# EAGLE design poe (EAGLE 9.6.2)
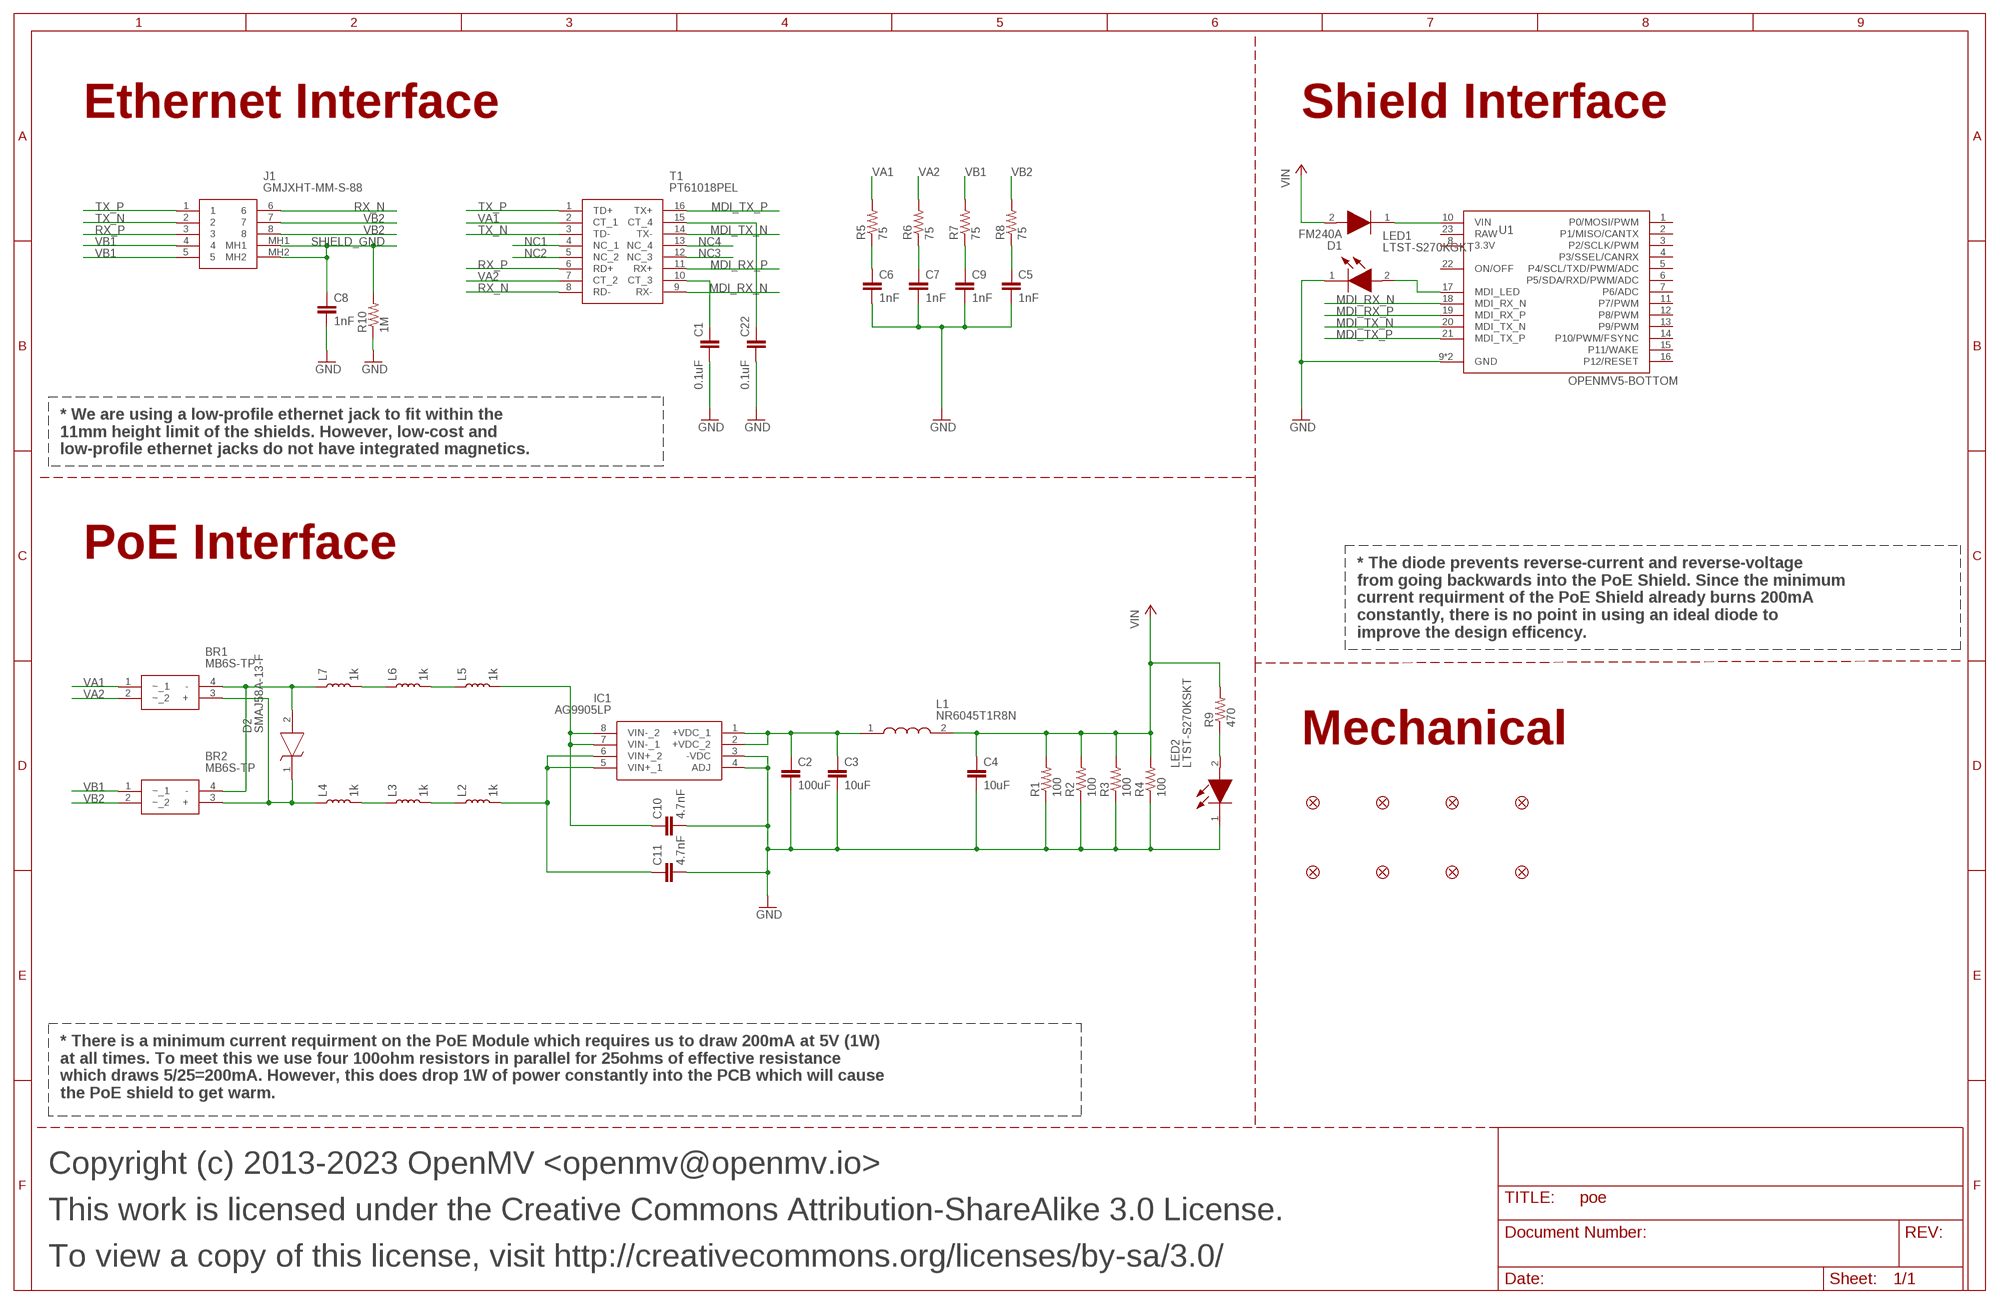
[diagram p0: schematic, sheet 1]

## Parts
BR1  MB6S-TP  [SOP254P665X270-4N]
BR2  MB6S-TP  [SOP254P665X270-4N]
C1  0.1uF  C-EUC0201  [C0201]
C2  100uF  C-EUC1206  [C1206]
C3  10uF  C-EUC0402  [C0402]
C4  10uF  C-EUC0402  [C0402]
C5  1nF  C-EUC1206  [C1206]
C6  1nF  C-EUC1206  [C1206]
C7  1nF  C-EUC1206  [C1206]
C8  1nF  C-EUC1206  [C1206]
C9  1nF  C-EUC1206  [C1206]
C10  4.7nF  C-EUC1812  [C1812]
C11  4.7nF  C-EUC1812  [C1812]
C22  0.1uF  C-EUC0201  [C0201]
D1  FM240A  [DIOM5025X231N]
D2  SMAJ58A-13-F  [DIOM5226X230N]
FD1  FIDUCIAL1X2  [FIDUCIAL-1X2]
FD2  FIDUCIAL1X2  [FIDUCIAL-1X2]
FD3  FIDUCIAL1X2  [FIDUCIAL-1X2]
FD4  FIDUCIAL1X2  [FIDUCIAL-1X2]
FD5  FIDUCIAL1X2  [FIDUCIAL-1X2]
FD6  FIDUCIAL1X2  [FIDUCIAL-1X2]
FD7  FIDUCIAL1X2  [FIDUCIAL-1X2]
FD8  FIDUCIAL1X2  [FIDUCIAL-1X2]
IC1  AG9905LP  [AG9905LP]
J1  GMJXHT-MM-S-88  [GMJXHTMMS88]
L1  NR6045T1R8N  [NR6045T1R8N]
L2  1k  INDUCTOR-0402-3.9NH  [0402]
L3  1k  INDUCTOR-0402-3.9NH  [0402]
L4  1k  INDUCTOR-0402-3.9NH  [0402]
L5  1k  INDUCTOR-0402-3.9NH  [0402]
L6  1k  INDUCTOR-0402-3.9NH  [0402]
L7  1k  INDUCTOR-0402-3.9NH  [0402]
LED1  LTST-S270KGKT  [LTSTS270K]
LED2  LTST-S270KSKT  [LTSTS270K]
R1  100  R-US_R2512  [R2512]
R2  100  R-US_R2512  [R2512]
R3  100  R-US_R2512  [R2512]
R4  100  R-US_R2512  [R2512]
R5  75  R-US_R0402  [R0402]
R6  75  R-US_R0402  [R0402]
R7  75  R-US_R0402  [R0402]
R8  75  R-US_R0402  [R0402]
R9  470  R-US_R0603  [R0603]
R10  1M  R-US_R1206  [R1206]
T1  PT61018PEL  [SOIC127P930X565-16N]
U1  OPENMV5-BOTTOM  [OPENMV5-BOTTOM]

## Nets
GND [gnd]: C1.2 C2.2 C3.2 C4.2 C5.2 C6.2 C7.2 C8.2 C9.2 C10.2 C11.2 C22.2 IC1.3(-VDC) IC1.4(ADJ) LED1.1(K) LED2.1(K) R1.1 R2.1 R3.1 R4.1 R10.1 U1.9(GND) U1.24(GND)
MDI_LED [signal]: LED1.2(A) U1.17(MDI_LED)
MDI_RX_CT [signal]: C1.1 T1.10(CT_3)
MDI_RX_N [mdi]: T1.9(RX-) U1.18(MDI_RX_N)
MDI_RX_P [mdi]: T1.11(RX+) U1.19(MDI_RX_P)
MDI_TX_CT [signal]: C22.1 T1.15(CT_4)
MDI_TX_N [mdi]: T1.14(TX-) U1.20(MDI_TX_N)
MDI_TX_P [mdi]: T1.16(TX+) U1.21(MDI_TX_P)
NC1 [iso]: T1.4(NC_1)
NC2 [iso]: T1.5(NC_2)
NC3 [mdi]: T1.12(NC_3)
NC4 [mdi]: T1.13(NC_4)
POE_VIN_INT_N [iso]: C10.1 IC1.7(VIN-_1) IC1.8(VIN-_2) L5.2
POE_VIN_INT_P [iso]: C11.1 IC1.5(VIN+_1) IC1.6(VIN+_2) L2.2
POE_VIN_N [iso]: BR1.4(-) BR2.4(-) D2.2(A) L7.1
POE_VIN_N0 [iso]: L6.1 L7.2
POE_VIN_N1 [iso]: L5.1 L6.2
POE_VIN_P [iso]: BR1.3(+) BR2.3(+) D2.1(K) L4.1
POE_VIN_P0 [iso]: L3.1 L4.2
POE_VIN_P1 [iso]: L2.1 L3.2
RX_N [iso]: J1.6 T1.8(RD-)
RX_P [iso]: J1.3 T1.6(RD+)
SHIELD_GND [iso]: C8.1 J1.MH1 J1.MH2 R10.2
TX_N [iso]: J1.2 T1.3(TD-)
TX_P [iso]: J1.1 T1.1(TD+)
VA1 [iso]: BR1.1(~_1) R5.2 T1.2(CT_1)
VA1_ISO [iso]: C6.1 R5.1
VA2 [iso]: BR1.2(~_2) R6.2 T1.7(CT_2)
VA2_ISO [iso]: C7.1 R6.1
VB1 [iso]: BR2.1(~_1) J1.4 J1.5 R7.2
VB1_ISO [iso]: C9.1 R7.1
VB2 [iso]: BR2.2(~_2) J1.7 J1.8 R8.2
VB2_ISO [iso]: C5.1 R8.1
VDC [power]: C2.1 C3.1 IC1.1(+VDC_1) IC1.2(+VDC_2) L1.1
VIN [power]: C4.1 D1.2(A) L1.2 R1.2 R2.2 R3.2 R4.2 R9.2
VIN_INT [power]: D1.1(K) U1.10(VIN)
VIN_LED [signal]: LED2.2(A) R9.1
Unconnected: U1.1(P0/MOSI/PWM) U1.2(P1/MISO/CANTX) U1.3(P2/SCLK/PWM) U1.4(P3/SSEL/CANRX) U1.5(P4/SCL/TXD/PWM/ADC) U1.6(P5/SDA/RXD/PWM/ADC) U1.7(P6/ADC) U1.8(3.3V) U1.11(P7/PWM) U1.12(P8/PWM) U1.13(P9/PWM) U1.14(P10/PWM/FSYNC) U1.15(P11/WAKE) U1.16(P12/RESET) U1.22(ON/OFF) U1.23(RAW)

## Notes on the sheet
- Ethernet Interface | Shield Interface
- * We are using a low-profile ethernet jack to fit within the
  11mm height limit of the shields. However, low-cost and
  low-profile ethernet jacks do not have integrated magnetics.
- PoE Interface
- * The diode prevents reverse-current and reverse-voltage
  from going backwards into the PoE Shield. Since the minimum
  current requirment of the PoE Shield already burns 200mA
  constantly, there is no point in using an ideal diode to
  improve the design efficency.
- Mechanical
- * There is a minimum current requirment on the PoE Module which requires us to draw 200mA at 5V (1W)
  at all times. To meet this we use four 100ohm resistors in parallel for 25ohms of effective resistance
  which draws 5/25=200mA. However, this does drop 1W of power constantly into the PCB which will cause
  the PoE shield to get warm.
- Copyright (c) 2013-2023 OpenMV <openmv@openmv.io>
- This work is licensed under the Creative Commons Attribution-ShareAlike 3.0 License.
- To view a copy of this license, visit http://creativecommons.org/licenses/by-sa/3.0/

## Library data of the parts
BR1 BR2 = MB6S-TP:MB6S-TP: MICRO COMMERCIAL COMPONENTS - MB6S-TP - BRIDGE RECTIFIER, 500mA, 600V Source: Datasheet <https://componentsearchengine.com/Datasheets/2/MB6S-TP.pdf>; DESCRIPTION: MICRO COMMERCIAL COMPONENTS - MB6S-TP - BRIDGE RECTIFIER, 500mA, 600V; HEIGHT: 2.7mm; MANUFACTURER_NAME: MCC; MANUFACTURER_PART_NUMBER: MB6S-TP; MOUSER_PART_NUMBER: 833-MB6S-TP; MOUSER_PRICE-STOCK: https://www.mouser.co.uk/ProductDetail/Micro-Commercial-Components-MCC/MB6S-TP?qs=O2qRfqcg9D9hSJLw3ZCqJw%3D%3D; MPN: MB6S-TP
C1 C22 = rcl:C-EU: CAPACITOR, European symbol; MPN: CL03A104KQ3NNNC; SPICEPREFIX: C
C2 = rcl:C-EU: CAPACITOR, European symbol; MPN: CL31A107MQHNNWE; SPICEPREFIX: C
C3 C4 = rcl:C-EU: CAPACITOR, European symbol; MPN: GRM155R60J106ME05D; SPICEPREFIX: C
C5-C9 = rcl:C-EU: CAPACITOR, European symbol; MPN: 1206B102K252CT; SPICEPREFIX: C
C10 C11 = rcl:C-EU: CAPACITOR, European symbol; MPN: 202S43W472KV4E; SPICEPREFIX: C
D1 = FM240A:FM240A: Diodes - General Purpose, Power, Switching GP Si Rectifier SMB,2A,40V Source: Datasheet <https://ms.componentsearchengine.com/Datasheets/1/FM240A.pdf>; DESCRIPTION: Diodes - General Purpose, Power, Switching GP Si Rectifier SMB,2A,40V; HEIGHT: 2.31mm; MANUFACTURER_NAME: Rectron; MANUFACTURER_PART_NUMBER: FM240A; MOUSER_PART_NUMBER: 583-FM240A; MOUSER_PRICE-STOCK: https://www.mouser.co.uk/ProductDetail/Rectron/FM240A?qs=7pEAo90IqNG7sknZwmLYhQ%3D%3D; MPN: FM240A
D2 = SMAJ58A-13-F:SMAJ58A-13-F: Diodes Inc SMAJ58A-13-F, Uni-Directional TVS Diode, 400W, 2-Pin DO-214AC Source: Datasheet <https://componentsearchengine.com/Datasheets/1/SMAJ58A-13-F.pdf>; DESCRIPTION: Diodes Inc SMAJ58A-13-F, Uni-Directional TVS Diode, 400W, 2-Pin DO-214AC; HEIGHT: 2.3mm; MANUFACTURER_NAME: Diodes Inc.; MANUFACTURER_PART_NUMBER: SMAJ58A-13-F; MOUSER_PART_NUMBER: 621-SMAJ58A-13-F; MOUSER_PRICE-STOCK: https://www.mouser.co.uk/ProductDetail/Diodes-Incorporated/SMAJ58A-13-F?qs=gaDBXWSqsDABoBswSRRvMQ%3D%3D; MPN: SMAJ58A/TR13
FD1-FD8 = SparkFun-Aesthetics:FIDUCIAL: Fiducial Alignment Points Point-of-reference for pick-and-place machines and other optical instruments.
IC1 = Ag9905LP:AG9905LP: Power Management Modules IEEE802.3af PD module. 5V 7W, low profile Source: Datasheet <https://silvertel.com/images/datasheets/Ag9900M-datasheet-ultra-miniature-isolated-Power-over-Ethernet-POE-module.pdf>; DESCRIPTION: Power Management Modules IEEE802.3af PD module. 5V 7W, low profile; HEIGHT: 8.5mm; MANUFACTURER_NAME: Silvertel; MANUFACTURER_PART_NUMBER: Ag9905LP; MOUSER_PART_NUMBER: 480-AG9905LP; MOUSER_PRICE-STOCK: https://www.mouser.co.uk/ProductDetail/Silvertel/Ag9905LP?qs=OlC7AqGiEDm9ZoM6zJQCoQ%3D%3D; MPN: Ag9905LP
J1 = GMJXHT-MM-S-88:GMJXHT-MM-S-88: MODJACK MIDMOUNT 8P8C SHIELD RoHS COMPLIANT Source: Datasheet <http://www.kycon.com/Pub_Eng_Draw/GMJXHT-MM-S-88.pdf>; DESCRIPTION: MODJACK MIDMOUNT 8P8C SHIELD RoHS COMPLIANT; HEIGHT: 10.1mm; MANUFACTURER_NAME: Kycon; MANUFACTURER_PART_NUMBER: GMJXHT-MM-S-88; MOUSER_PART_NUMBER: 806-GMJXHT-MM-S-88; MOUSER_PRICE-STOCK: https://www.mouser.co.uk/ProductDetail/Kycon/GMJXHT-MM-S-88?qs=2OnyuXx6vpiODS6CjVUhnA%3D%3D; MPN: GMJXHT-MM-S-88
L1 = NR6045T1R8N:NR6045T1R8N: Inductor Power Shielded Wirewound 1.8uH 30% 100KHz Ferrite 3.7A 0.0234Ohm DCR 2424 T/R Source: Datasheet <https://www.mouser.in/datasheet/2/396/wound04_e-1290968.pdf>; DESCRIPTION: Inductor Power Shielded Wirewound 1.8uH 30% 100KHz Ferrite 3.7A 0.0234Ohm DCR 2424 T/R; HEIGHT: 4.5mm; MANUFACTURER_NAME: TAIYO YUDEN; MANUFACTURER_PART_NUMBER: NR6045T1R8N; MOUSER_PART_NUMBER: 963-NR6045T1R8N; MOUSER_PRICE-STOCK: https://www.mouser.co.uk/ProductDetail/Taiyo-Yuden/NR6045T1R8N?qs=PzICbMaShUeSTOagIkrBuw%3D%3D; MPN: NR6045T1R8N
L2-L7 = SparkFun-Coils:INDUCTOR: Inductors Resist changes in electrical current. Basically a coil of wire. SparkFun Products: SparkFun Load Cell Amplifier - HX711 <https://www.sparkfun.com/products/13879> IOIO-OTG - V2.2 <https://www.sparkfun.com/products/13613>; MPN: BBPY00100505102Y00; PROD_ID: NDUC-13457; VALUE: 3.9NH
LED1 = LTST-S270K:LTST-S270KGKT: LED,0603,Side View,Green,35mcd Lite-On LTST-S270KGKT Green LED,571 nm 1608 (0603) Side View, Rectangle Lens SMD package Source: Datasheet <https://www.mouser.com/datasheet/2/239/LTST-S270KGKT-1175381.pdf>; DESCRIPTION: LED,0603,Side View,Green,35mcd Lite-On LTST-S270KGKT Green LED, 571 nm 1608 (0603) Side View, Rectangle Lens SMD package; HEIGHT: 1mm; MANUFACTURER_NAME: Lite-On; MANUFACTURER_PART_NUMBER: LTST-S270KGKT; MOUSER_PART_NUMBER: 859-LTST-S270KGKT; MOUSER_PRICE-STOCK: https://www.mouser.com/ProductDetail/Lite-On/LTST-S270KGKT?qs=oL5uk4n%2FG821%2FMiCU6RADg%3D%3D; MPN: LTST-S270KGKT
LED2 = LTST-S270K:LTST-S270KSKT: LED,0603,Side View,Yellow,60mcd Lite-On LTST-S270KSKT Yellow LED, 589 nm 1608 (0603) Side View, Rectangle Lens SMD package Source: Datasheet <https://www.mouser.com/datasheet/2/239/LTST-S270KSKT-1175549.pdf>; DESCRIPTION: LED,0603,Side View,Yellow,60mcd Lite-On LTST-S270KSKT Yellow LED, 589 nm 1608 (0603) Side View, Rectangle Lens SMD package; HEIGHT: 1mm; MANUFACTURER_NAME: Lite-On; MANUFACTURER_PART_NUMBER: LTST-S270KSKT; MOUSER_PART_NUMBER: 859-LTST-S270KSKT; MOUSER_PRICE-STOCK: https://www.mouser.com/ProductDetail/Lite-On/LTST-S270KSKT?qs=1%252Ba%252Bh4jXs3oCxYgJuiLmrQ%3D%3D; MPN: LTST-S270KSKT
R1-R4 = rcl:R-US_: RESISTOR, American symbol; MPN: RC2512JK-07100RL; SPICEPREFIX: R
R5-R8 = rcl:R-US_: RESISTOR, American symbol; MPN: 0402WGF750JTCE; SPICEPREFIX: R
R9 = rcl:R-US_: RESISTOR, American symbol; MPN: 0603WAJ0471T5E; SPICEPREFIX: R
R10 = rcl:R-US_: RESISTOR, American symbol; MPN: RMCF1206FT1M00; SPICEPREFIX: R
T1 = PT61018PEL:PT61018PEL: BOURNS - PT61018PEL - TRANSFORMER, LAN, 1CT:1CT, 350UH, SMD Source: Datasheet <https://www.bourns.com/docs/Product-Datasheets/PT61018PEL.pdf>; DESCRIPTION: BOURNS - PT61018PEL - TRANSFORMER, LAN, 1CT:1CT, 350UH, SMD; HEIGHT: 5.65mm; MANUFACTURER_NAME: Bourns; MANUFACTURER_PART_NUMBER: PT61018PEL; MOUSER_PART_NUMBER: 652-PT61018PEL; MOUSER_PRICE-STOCK: https://www.mouser.co.uk/ProductDetail/Bourns/PT61018PEL?qs=G1LhLIAbs1x4VqIQtFg%252BEw%3D%3D; MPN: PT61018PEL
U1 = openmv5:OPENMV5-BOTTOM

## Net classes
0 default: width 0.127 mm, drill 0.254 mm, clearance 0.127 mm
1 mdi: width 0.203 mm, drill 0.254 mm, clearance 0.127 mm to class 0, clearance 0.127 mm
2 gnd: width 0.127 mm, drill 0.254 mm, clearance 0.127 mm to class 0, clearance 0.127 mm to class 1, clearance 0.127 mm
3 signal: width 0.203 mm, drill 0.254 mm, clearance 0.127 mm to class 0, clearance 0.127 mm to class 1, clearance 0.127 mm to class 2, clearance 0.127 mm
4 iso: width 0.127 mm, drill 0.254 mm, clearance 1.143 mm to class 0, clearance 1.143 mm to class 1, clearance 1.143 mm to class 2, clearance 1.143 mm to class 3, clearance 0.127 mm
5 power: width 0.127 mm, drill 0.254 mm, clearance 0.127 mm to class 0, clearance 0.127 mm to class 1, clearance 0.127 mm to class 2, clearance 0.127 mm to class 3, clearance 0.127 mm to class 4, clearance 0.127 mm

## Board
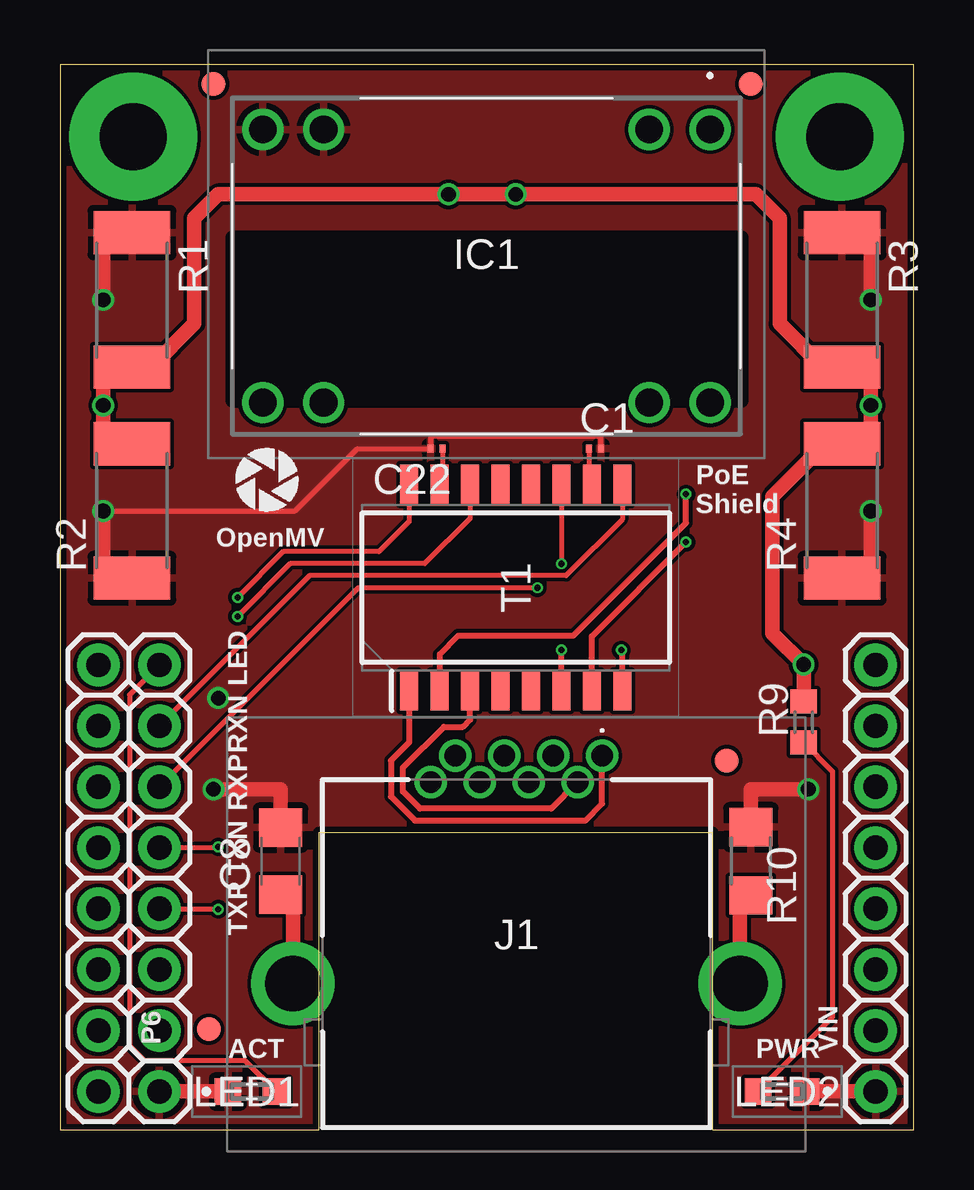
[diagram p1: board, top side]
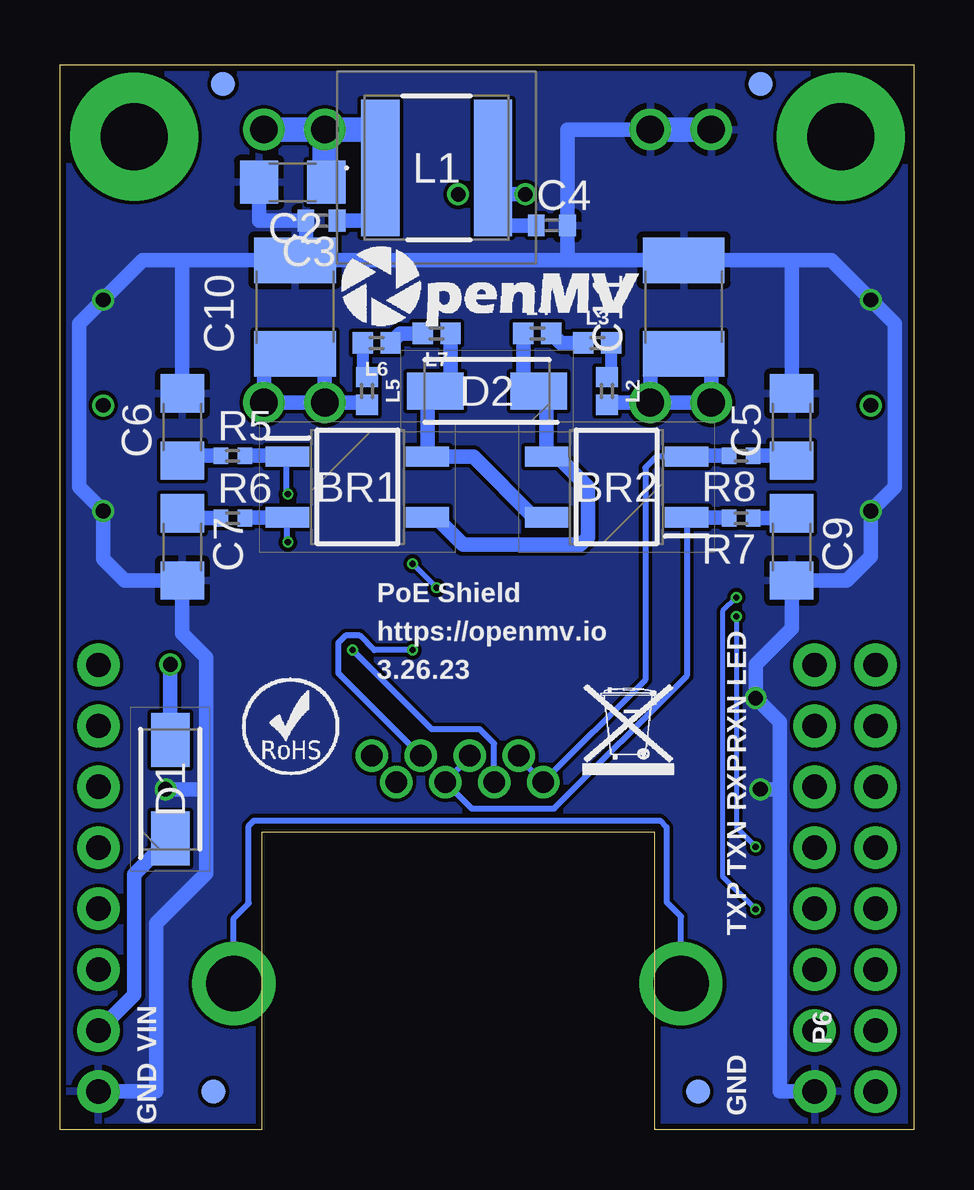
[diagram p2: board, bottom side, seen from below]

Size 35.6 x 44.4 mm. Coordinates in mm from the lower left corner, seen from the top.
Outline: 0,0 10.8,0 10.8,12.4 27.2,12.4 27.2,0 35.6,0 35.6,44.4 0,44.4 0,0
Copper layers (1*16): Top 0.035mm / dielectric 1.5mm / Bottom 0.035mm
Design rules "MF_Standard_2_Layer *": minimum track width 5mil, minimum drill 10mil, track to track 5mil, track to pad 5mil, pad to pad 5mil, via to via 5mil, smd to smd 0mil, copper to edge 10mil, drill to drill 10mil, minimum pad ring 4mil, minimum via ring 4mil, stop-mask expansion 2mil, vias tented up to drill 25mil, thermal gap 10mil
tRestrict: area 7.2,30.4 to 28.4,37.2

### Footprints (pad centres in the part's own frame; a part is rotated, then mirrored left to right if it is on the bottom)
SOP254P665X270-4N = smd 1.8 x 0.85: 1 -2.925,1.27; 2 -2.925,-1.27; 3 2.925,-1.27; 4 2.925,1.27
C0201 = smd 0.25 x 0.35: 1 -0.25,0; 2 0.25,0
C1206 = smd 1.6 x 1.8: 1 -1.4,0; 2 1.4,0
C0402 = smd 0.7 x 0.9: 1 -0.65,0; 2 0.65,0
C1812 = smd 1.9 x 3.4: 1 -1.95,0; 2 1.95,0
DIOM5025X231N = smd 2.25 x 1.6: 1 -2.05,0; 2 2.05,0
DIOM5226X230N = smd 2.35 x 1.55: 1 -2.15,0; 2 2.15,0
FIDUCIAL-1X2 = smd 1 x 1: 1 0,0
AG9905LP = drill 1.15 pad 1.725: 1 0,0; 2 2.54,0; 3 16.11,0; 4 18.65,0; 5 18.65,11.38; 6 16.11,11.38; 7 2.54,11.38; 8 0,11.38
GMJXHTMMS88 = drill 0.9 pad 1.2: 1 0,0; 2 -1.02,-1.1; 3 -2.04,0; 4 -3.06,-1.1; 5 -4.08,0; 6 -5.1,-1.1; 7 -6.12,0; 8 -7.14,-1.1 | drill 2.31 pad 3.465: MH1 5.751,-9.5; MH2 -12.889,-9.5
NR6045T1R8N = smd 1.6 x 5.7: 1 -2.35,0; 2 2.35,0
0402 = smd 0.85 x 0.9: 1 -0.58,0; 2 0.58,0
LTSTS270K = smd 1.1 x 1.1: 1 -1,0; 2 1,0
R2512 = smd 1.8 x 3.2: 1 -2.8,0; 2 2.8,0
R0402 = smd 0.6 x 0.7: 1 -0.5,0; 2 0.5,0
R0603 = smd 1 x 1.1: 1 -0.85,0; 2 0.85,0
R1206 = smd 1.6 x 1.803: 1 -1.422,0; 2 1.422,0
SOIC127P930X565-16N = smd 1.65 x 0.75: 1 -4.3,4.445; 2 -4.3,3.175; 3 -4.3,1.905; 4 -4.3,0.635; 5 -4.3,-0.635; 6 -4.3,-1.905; 7 -4.3,-3.175; 8 -4.3,-4.445; 9 4.3,-4.445; 10 4.3,-3.175; 11 4.3,-1.905; 12 4.3,-0.635; 13 4.3,0.635; 14 4.3,1.905; 15 4.3,3.175; 16 4.3,4.445
OPENMV5-BOTTOM = drill 1.016 pad 1.778: 1 1.6,19.38; 2 1.6,16.84; 3 1.6,14.3; 4 1.6,11.76; 5 1.6,9.22; 6 1.6,6.68; 7 1.6,4.14; 8 1.6,1.6; 9 34,1.6; 10 34,4.14; 11 34,6.68; 12 34,9.22; 13 34,11.76; 14 34,14.3; 15 34,16.84; 16 34,19.38; 17 4.14,19.38; 18 4.14,16.84; 19 4.14,14.3; 20 4.14,11.76; 21 4.14,9.22; 22 4.14,6.68; 23 4.14,4.14; 24 4.14,1.6 | drill 2.8 pad 5.334: 25 3.048,41.402; 26 32.512,41.402

### Placement (x,y rotation side)
BR1  23.2,26.8 0 bottom
BR2  12.4,26.8 180 bottom
C1  22.3,28.4 0 top
C2  25.9,39.5 180 bottom
C3  24.7,37.9 180 bottom
C4  15.1,37.7 0 bottom
C5  5.1,29.3 90 bottom
C6  30.5,29.3 90 bottom
C7  30.5,24.3 270 bottom
C8  9.2,11.2 90 top
C9  5.1,24.3 270 bottom
C10  25.8,34.3 90 bottom
C11  9.6,34.3 90 bottom
C22  15.7,28.4 180 top
D1  31,14.2 90 bottom
D2  17.8,30.8 180 bottom
FD1  6.2,4.2 0 top
FD2  27.8,15.4 0 top
FD3  28.8,43.6 0 top
FD4  6.4,43.6 0 top
FD5  9,1.6 0 bottom
FD6  29.2,1.6 0 bottom
FD7  28.8,43.6 0 bottom
FD8  6.4,43.6 0 bottom
IC1  27.1,41.7 180 top
J1  22.6,15.6 0 top
L1  19.9,40.1 0 bottom
L2  12.8,30.8 270 bottom
L3  13.2,32.8 0 bottom
L4  15.7,33.2 0 bottom
L5  22.8,30.8 270 bottom
L6  22.4,32.8 180 bottom
L7  19.9,33.2 180 bottom
LED1  8,1.6 0 top
LED2  30.1,1.6 180 top
R1  3,34.6 270 top
R2  3,25.8 90 top
R3  32.6,34.6 270 top
R4  32.6,25.8 90 top
R5  28.4,28.1 0 bottom
R6  28.4,25.5 0 bottom
R7  7.2,25.5 180 bottom
R8  7.2,28.1 180 bottom
R9  31,17 90 top
R10  28.8,11.2 270 top
T1  19,22.6 90 top
U1  0,0 0 top
U$1  [WEEE]  13.8,14.8 0 bottom
U$2  [ROHS]  28,14.8 0 bottom
U$3  [OMV-LOGO]  24,33.3 0 bottom
U$9  OPENMV-LOGO  [OPENMV-LOGO]  7.2,25.6 0 top

### Tracks (layer width: path | path; a pad name or v marks a point on that pad's centre or on a via)
GND  (via drill 0.61)
  Top 0.203: v1.8,25.8 9.8,25.8 12.4,28.4 C22.2 15.45,28.85 15.5,28.9 22.5,28.9 22.55,28.85 C1.2
  Top 0.61: R1.1 1.8,37.4 v1.8,34.6 | v1.8,25.8 1.8,23 R2.1 | v33.8,25.8 33.8,23 R4.1 | R3.1 33.8,37.4 v33.8,34.6 | U1.9 LED2.1 | U1.24 LED1.1 | C8.2 9.2,14.2 v6.4,14.2 | R10.1 28.8,14.2 v31.2,14.2
  Bottom 0.61: C2.2 27.3,37.9 C3.2 25.35,36.25 C10.2 | IC1.3 14.45,41.7 C4.2 14.45,36.25 | 14.45,36.25 C11.2 5.1,36.25 | C10.2 14.45,36.25 | 5.1,36.25 3.45,36.25 v1.8,34.6 0.8,33.6 0.8,26.8 v1.8,25.8 1.8,23.9 2.8,22.9 C9.2 5.1,20.9 6.6,19.4 v6.6,18 5.6,17 5.6,14.2 | C10.2 30.5,36.25 | 30.5,36.25 32.15,36.25 v33.8,34.6 34.8,33.6 34.8,26.8 v33.8,25.8 33.8,23.8 32.9,22.9 C7.2 30.5,20.7 29.5,19.7 29.5,14.2 | C6.2 30.5,36.25 | C5.2 5.1,36.25 | U1.9 31.6,1.6 31.6,8.6 29.5,10.7 29.5,14.2 | U1.24 5.6,1.6 5.6,14.2 | v6.4,14.2 5.6,14.2 | v31.2,14.2 29.5,14.2
  Bottom 1.016: IC1.4 IC1.3
  pour Bottom (isolate 0.152, rank 2): 0.2,0.2 35.4,0.2 35.4,44.2 0.2,44.2
  pour Top (isolate 0.152, rank 2): 0.1,0.1 35.5,0.1 35.5,44.3 arc1 0.1,44.3
MDI_LED
  Top 0.203: U1.17 2.9,18.14 2.9,3.5 3.5,2.9 7.7,2.9 LED1.2
MDI_RX_CT
  Top 0.203: C1.1 22.05,27.02 T1.10
MDI_RX_N
  Top 0.203: T1.9 23.45,25.45 21.1,23.1 10.4,23.1 U1.18
MDI_RX_P  (via drill 0.25)
  Top 0.203: T1.11 v20.91,23.61 v20.9,23.6 | U1.19 12.44,22.6 v19.9,22.6 | v19.9,22.6
  Bottom 0.203: v19.9,22.6 v20.9,23.6
MDI_TX_CT
  Top 0.203: C22.1 15.95,27.02 T1.15
MDI_TX_N  (via drill 0.25)
  Top 0.203: T1.14 17.09,25.5 15.2,23.6 9.6,23.6 v7.4,21.4 | v6.6,11.8 6.56,11.76 U1.20
  Bottom 0.203: v7.4,21.4 7.4,12.6 v6.6,11.8
MDI_TX_P  (via drill 0.25)
  Top 0.203: T1.16 14.55,25.36 13.3,24.1 9.3,24.1 v7.4,22.2 | U1.21 6.58,9.22 v6.6,9.2
  Bottom 0.203: v7.4,22.2 7.98,21.62 7.98,10.58 v6.6,9.2
POE_VIN_INT_N
  Bottom 0.61: IC1.7 24.56,32.35 C10.1 27.1,32.35 IC1.8 IC1.7 | IC1.7 22.9,30.32 L5.2
POE_VIN_INT_P
  Bottom 0.61: IC1.6 IC1.5 8.45,32.35 C11.1 10.99,32.35 IC1.6 | IC1.6 12.7,30.32 L2.2
POE_VIN_N
  Bottom 0.61: L7.1 19.32,31.18 19.57,31.18 D2.2 20.27,30.8 BR1.4 18.37,28.07 15.83,25.53 BR2.4
POE_VIN_N0
  Bottom 0.61: L6.1 21.42,33.2 L7.2
POE_VIN_N1
  Bottom 0.508: L6.2 22.98,31.56 L5.1
POE_VIN_P
  Bottom 0.61: BR1.3 19.93,25.53 18.8,24.4 13.9,24.4 13.6,24.7 13.6,26.8 14.87,28.07 BR2.3 15.32,31 15.51,31.18 16.28,31.18 L4.1 16.28,31.43 D2.1
POE_VIN_P0
  Bottom 0.61: L4.2 14.72,32.8 L3.1
POE_VIN_P1
  Bottom 0.508: L2.1 12.62,31.56 L3.2
RX_N  (via drill 0.25)
  Top 0.254: T1.8 23.45,19.95 v23.4,20
  Bottom 0.254: J1.6 17.5,16.1 18.1,16.7 20.1,16.7 v23.4,20
RX_P  (via drill 0.25)
  Top 0.254: T1.6 v20.91,20 v20.9,20
  Bottom 0.254: v20.9,20 22.5,20 23.1,20.6 23.7,20.6 24,20.3 24,19.04 J1.3
SHIELD_GND
  Top 0.61: C8.1 9.71,9.29 J1.MH2 | R10.2 28.35,9.33 J1.MH1
  Bottom 0.254: J1.MH2 9.71,8.9 10.31,9.5 10.31,12.61 10.6,12.9 27.5,12.9 27.73,12.68 27.73,9.45 28.35,8.82 J1.MH1
TX_N
  Top 0.254: J1.2 20.48,13.4 15,13.4 14.3,14.1 14.3,15.1 16,16.8 16.8,16.8 17.1,17.1 T1.3
TX_P
  Top 0.254: T1.1 14.55,16.16 13.8,15.4 13.8,13.9 14.8,12.9 21.9,12.9 22.6,13.6 J1.1
VA1  (via drill 0.25)
  Top 0.254: T1.2 15.82,19.82 16.6,20.6 21.4,20.6 26.1,25.3 v26.1,26.5
  Bottom 0.254: v26.1,26.5 26.16,26.55 26.16,28.1
  Bottom 0.61: R5.2 26.16,28.1 BR1.1
VA1_ISO
  Bottom 0.61: R5.1 30.3,28.1 C6.1
VA2  (via drill 0.25)
  Top 0.254: T1.7 22.18,20.57 v26.1,24.5
  Bottom 0.254: v26.1,24.5 26.12,24.52 BR1.2
  Bottom 0.61: BR1.2 27.87,25.53 R6.2
VA2_ISO
  Bottom 0.61: R6.1 30.3,25.5 C7.1
VB1
  Bottom 0.254: BR2.1 9.47,18.93 15,13.4 18.44,13.4 J1.4 18.52,15.52 J1.5
  Bottom 0.61: BR2.1 7.73,25.53 R7.2
VB1_ISO
  Bottom 0.61: R7.1 5.3,25.5 C9.1
VB2
  Bottom 0.254: BR2.2 10.73,28.07 11.2,27.6 11.2,18.76 J1.8 16.48,15.52 J1.7
  Bottom 0.61: R8.2 9.45,28.1 BR2.2
VB2_ISO
  Bottom 0.61: R8.1 5.3,28.1 C5.1
VDC
  Bottom 0.61: L1.1 22.25,39.6 22,39.35 22,37.6 22.3,37.9 C3.1
  Bottom 1.016: IC1.1 IC1.2 | IC1.2 22.25,41.7 L1.1 | IC1.2 24.56,39.56 C2.1
VIN  (via drill 0.61)
  Top 0.61: R2.2 1.8,28.6 v1.8,30.2 1.8,31.8 R1.2 3.8,31.8 5.6,33.6 5.6,38 6.6,39 v16.2,39 v19,39 29,39 30,38 30,33.6 31.8,31.8 R3.2 33.8,31.8 v33.8,30.2 33.8,28.6 R4.2 31.9,28.6 29.7,26.4 29.7,20.7 v31,19.4 R9.2
  Bottom 0.61: C4.1 17.55,37.7 L1.2 17.55,39 v16.2,39 | v31,19.4 D1.2
VIN_INT
  Bottom 0.61: D1.1 32.5,10.65 32.5,5.64 U1.10
VIN_LED
  Top 0.203: LED2.2 32.2,4.7 32.2,14.95 R9.1

### Text on the board
tPlace: PoE / Shield | OpenMV | LED | RXN | RXP | TXN | TXP | VIN | P6 | ACT | PWR
bPlace: PoE Shield | https://openmv.io | 3.26.23 | LED | RXN | RXP | TXN | TXP | VIN | P6 | GND | GND